# Altium schematic sheet OutputStage.SchDoc: Output stage
size A4; Revision: 1.0; SheetNumber: 4; SheetTotal: 5; Alumno: Trotta, Ignacio; Curso: R1001; Materia: Sistemas de Representación; Docentes: JM Perdomo, E Ipar
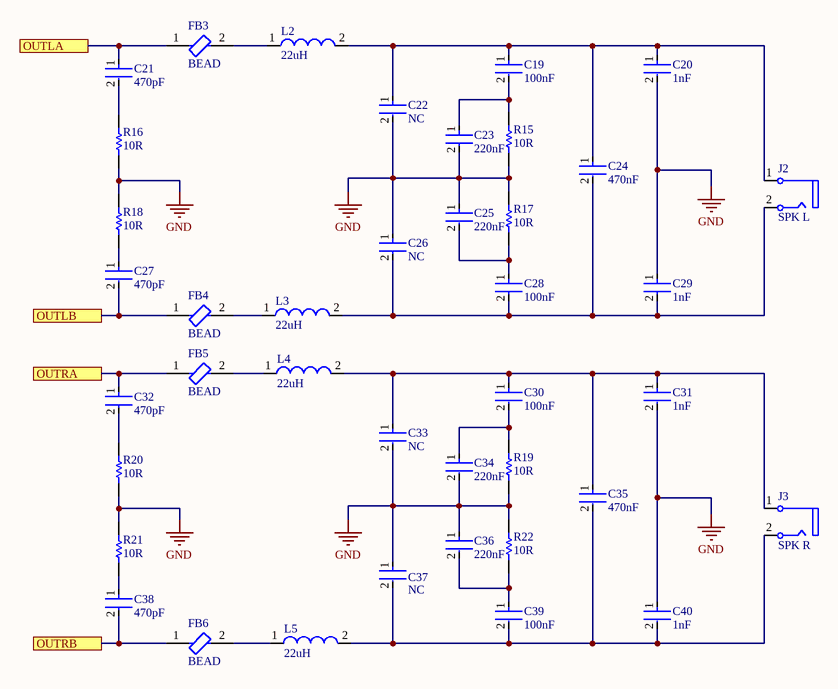
[diagram p0: OutputStage.SchDoc]

## Parts
C19  100nF  [FP-CC0805-0_85-MFG]
C20  1nF  [FP-CC0603-DA-MFG]
C21  470pF  [FP-CC0603-DA-MFG]
C22  NC  [FP-CL31-IPC_C]
C23  220nF  [FP-CC0805-0_85-MFG]
C24  470nF  [FP-CC0603-DA-MFG]
C25  220nF  [FP-CC0805-0_85-MFG]
C26  NC  [FP-CL31-IPC_C]
C27  470pF  [FP-CC0603-DA-MFG]
C28  100nF  [FP-CC0805-0_85-MFG]
C29  1nF  [FP-CC0603-DA-MFG]
C30  100nF  [FP-CC0805-0_85-MFG]
C31  1nF  [FP-CC0603-DA-MFG]
C32  470pF  [FP-CC0603-DA-MFG]
C33  NC  [FP-CL31-IPC_C]
C34  220nF  [FP-CC0805-0_85-MFG]
C35  470nF  [FP-CC0603-DA-MFG]
C36  220nF  [FP-CC0805-0_85-MFG]
C37  NC  [FP-CL31-IPC_C]
C38  470pF  [FP-CC0603-DA-MFG]
C39  100nF  [FP-CC0805-0_85-MFG]
C40  1nF  [FP-CC0603-DA-MFG]
FB3  BEAD  [FP-BLM18-0_15-t0_8-IPC_B]
FB4  BEAD  [FP-BLM18-0_15-t0_8-IPC_B]
FB5  BEAD  [FP-BLM18-0_15-t0_8-IPC_B]
FB6  BEAD  [FP-BLM18-0_15-t0_8-IPC_B]
J2  SPK L  [CUI-RCJ-041_V]
J3  SPK R  [CUI-RCJ-041_V]
L2  22uH  [WE-PD-XXL]
L3  22uH  [WE-PD-XXL]
L4  22uH  [WE-PD-XXL]
L5  22uH  [WE-PD-XXL]
R15  10R  [RESC3116X65X40NL10T20]
R16  10R  [RESC1608X55X25ML10T15]
R17  10R  [RESC3116X65X40NL10T20]
R18  10R  [RESC1608X55X25ML10T15]
R19  10R  [RESC3116X65X40NL10T20]
R20  10R  [RESC1608X55X25ML10T15]
R21  10R  [RESC1608X55X25ML10T15]
R22  10R  [RESC3116X65X40NL10T20]

## Ports
OUTLA, OUTLB, OUTRA, OUTRB

## Nets
GND: C20.2 C22.2 C23.2 C25.1 C26.1 C29.1 C31.2 C33.2 C34.2 C36.1 C37.1 C40.1 R15.1 R16.1 R17.2 R18.2 R19.1 R20.1 R21.2 R22.2
OUTLA: C21.1 FB3.1 ; port OUTLA
OUTLB: C27.2 FB4.1 ; port OUTLB
OUTRA: C32.1 FB5.1 ; port OUTRA
OUTRB: C38.2 FB6.1 ; port OUTRB
NetC19_1: C19.1 C20.1 C22.1 C24.1 J2.1 L2.2
NetC19_2: C19.2 C23.1 R15.2
NetC21_2: C21.2 R16.2
NetC24_2: C24.2 C26.2 C28.2 C29.2 J2.2 L3.2
NetC25_2: C25.2 C28.1 R17.1
NetC27_1: C27.1 R18.1
NetC30_1: C30.1 C31.1 C33.1 C35.1 J3.1 L4.2
NetC30_2: C30.2 C34.1 R19.2
NetC32_2: C32.2 R20.2
NetC35_2: C35.2 C37.2 C39.2 C40.2 J3.2 L5.2
NetC36_2: C36.2 C39.1 R22.1
NetC38_1: C38.1 R21.1
NetFB3_2: FB3.2 L2.1
NetFB4_2: FB4.2 L3.1
NetFB5_2: FB5.2 L4.1
NetFB6_2: FB6.2 L5.1

## Notes on the sheet
- Title:
- Revision:
- Alumno:
- Materia:
- Docentes:
- Curso:
- File:
- Date:
- Sheet
- of

## Library data of the parts
C19 C28 C30 C39 = CMP-03422-000996-1: CAP CER 0.22UF 50V X7R 0805; Manufacturer: Yageo; Manufacturer Part Number: CC0805KKX7R9BB224; Description: CC0805 220 nF X7R 10.00% 50 V; Tolerance: 0.1; Capacitance: 220 nF; Value: 220 nF; Material: Ceramic; ComponentLink2Description: Datasheet; Temperature Range Low: -30°C; Package: CC0805-0.85; Ipc Land Pattern Name: CAPC200125X85; Lead Free: Yes; Temperature Range High: +85°C; Category: Cap; Temperature: -30°C to +85°C; RoHS: TRUE; Device Class L3: Ceramic Capacitors; ComponentLink2URL: http://www.yageo.com/documents/recent/UPY-GPHC_Y5V_6.3V-to-50V_8.pdf; Voltage Rating: 50 V; Octopart: https://octopart.com/cc0805kkx7r9bb224-yageo-20779595; Digikey Description: CAP CER 0.22UF 50V X7R 0805; Device Class L1: Passive Components; Temperature Characteristic: X7R; Footprint Url: http://www.yageo.com/exep/pages/download/literatures/UPY-C_GEN_24.pdf; Height: 0.95mm; Device Class L2: Capacitors; Automotive: No; Mouser Description: Multilayer Ceramic Capacitors MLCC - SMD/SMT 220nF 50V X7R 10%
C20 C21 C24 C27 C29 C31 C32 C35 C38 C40 = CMP-2100-03600-2: CAP CER 10000PF 50V X7R 0603; Manufacturer Part Number: CC0603KRX7R9BB103; Manufacturer: YAGEO; Tolerance: 0.1; Material: Ceramic; Temperature Coefficient: 15%; Description: CC0603 10 nF X7R 10.00% 50 V; Value: 10 nF; Mouser Description: Multilayer Ceramic Capacitor, CC Series, 0.01 - F, - 10%, X7R, 50 V, 0603 [1608 Metric]; Digikey Description: CAP CER 10000PF 50V X7R 0603; Height: 0.9mm; Category: Cap; Temperature Characteristic: X7R; Footprint Url: http://www.yageo.com/exep/pages/download/literatures/UPY-C_GEN_24.pdf; Lead Free: Yes; Voltage Rating: 50 V; Temperature: -55°C to +125°C; Device Class L3: Ceramic Capacitors; ComponentLink2Description: Datasheet; Voltage: 50 V; Package: CC0603-DA; Octopart: https://octopart.com/cc0603krx7r9bb103-yageo-192938; Automotive: No; Temperature Range High: +125°C; Temperature Range Low: -55°C; RoHS: TRUE; Device Class L1: Passive Components; ComponentLink2URL: http://www.yageo.com/documents/recent/UPY-GPHC_X7R_6.3V-to-50V_18.pdf; Device Class L2: Capacitors; Capacitance: 10 nF
C22 C26 C33 C37 = CMP-13271-000934-1: Cap Ceramic 1nF 2kV X7R ±20% SMD 1206 +125°C Embossed T/R; Width: 0.063inch; Voltage Rating (DC): 2kV; Voltage Rating: 2kV; Package Quantity: 1; Max Operating Temperature: 125°C; Mount: Surface Mount; Packaging: Tape and Reel; Length: 0.126inch; Capacitance: 1nF; Case Code (Imperial): 1206; Min Operating Temperature: -55°C; Case/Package: 1206; Case Code (Metric): 3216; Tolerance: 20%; Thickness: 0.071inch
C23 C25 C34 C36 = CMP-03422-000996-1: CAP CER 0.22UF 50V X7R 0805; Manufacturer: Yageo; Manufacturer Part Number: CC0805KKX7R9BB224; Description: CC0805 220 nF X7R 10.00% 50 V; Tolerance: 0.1; Material: Ceramic; ComponentLink2Description: Datasheet; Temperature Range Low: -30°C; Package: CC0805-0.85; Ipc Land Pattern Name: CAPC200125X85; Lead Free: Yes; Temperature Range High: +85°C; Category: Cap; Temperature: -30°C to +85°C; RoHS: TRUE; Device Class L3: Ceramic Capacitors; ComponentLink2URL: http://www.yageo.com/documents/recent/UPY-GPHC_Y5V_6.3V-to-50V_8.pdf; Voltage Rating: 50 V; Octopart: https://octopart.com/cc0805kkx7r9bb224-yageo-20779595; Capacitance: 220 nF; Value: 220 nF; Digikey Description: CAP CER 0.22UF 50V X7R 0805; Device Class L1: Passive Components; Temperature Characteristic: X7R; Footprint Url: http://www.yageo.com/exep/pages/download/literatures/UPY-C_GEN_24.pdf; Height: 0.95mm; Device Class L2: Capacitors; Automotive: No; Mouser Description: Multilayer Ceramic Capacitors MLCC - SMD/SMT 220nF 50V X7R 10%
FB3-FB6 = CMP-0686-00503-3: Chip Ferrite Bead, 0603, 75Ω @ 100MHz, 0.3Ω, 25%, 600mA; Resistance: 350mR; Max DC Current: 500mA; Shielding: Unshielded; Number of Lines: 1; Impedance: 75R; Conductor Material: Copper; Material: Steel; DC Resistance (DCR): 300mR; Temperature Coefficient: 10ppm/°C; Max Current Rating: 500mA; Case/Package: 0603; Case Code (Imperial): 0603; DC Current: 500mA; Test Frequency: 100MHz; Military Standard: Not; Series: BLM18B; Min Operating Temperature: -55°C; Number of Pins: 2; Termination: SMD/SMT; Length: 1.6mm; Packaging: Tape and Reel; Max Operating Temperature: 125°C; Package Quantity: 1; REACH SVHC: No SVHC; Height: 0.8mm; Radiation Hardening: No; Depth: 0.8mm; Tolerance: 25%; Current Rating: 500mA; Width: 0.8mm; Core Material: Ferrite; RoHS Compliant: Yes; DC Resistance-Max: 300mR; Lead Free: Lead Free; Case Code (Metric): 1608; Number of Circuits: 1
J2 J3 = CMP-1692-00002-1: Female RCJ Jack, 2 Position, Height 11.724 mm, Tail Length 4 mm, RoHS, Bulk; Case\Package: Metal; Connector Type: HDMI; Current Rating: 500 mA; Voltage Rating: 40 V; Length: 16.2 mm; Pins: 19; ComponentLink1URL: http://www.cui.com/; ComponentLink1Description: Manufacturer URL; Packaging: Tape and Reel; Lead Pitch: 0.5 mm; PackageDescription: Female RCJ Jack, 2 Position, Height 11.724 mm, Tail Length 4 mm; RoHSCompliant: true; Min Operating Temperature: -55 degC; Height: 6.1 mm; Contact Material: Copper; REACH SVHC: No SVHC; DatasheetVersion: Rev. B, 02/2012; ComponentLink2Description: Datasheet; Contact Plating: Gold; Colour: Black; Max Operating Temperature: 85 degC; Mount: Surface Mount; Package Quantity: 400; Gender: Female; ComponentLink2URL: http://www.cui.com/product/resource/rcj-04x.pdf; PackageReference: RCJ-041
L2-L5 = CMP-0227-00178-1: SMD-Shielded Power Inductor WE-PD, L = 22.0 µH; Inductance: 22.0 ÂµH; DatasheetVersion: ver 1, Oct-2004; ComponentLink2URL: http://www.we-online.de/katalog/media/pdf/7447709220.pdf; PackageDescription: SMD Inductor, 2-Leads, Body 12.0 x 12.0 mm; PackageVersion: 2004; ComponentLink2Description: Datasheet; PackageReference: WE-PD-XXL; ComponentLink1URL: http://www.we-online.com; ComponentLink1Description: Manufacturer Link
R15 R17 R19 R22 = CMP-2003-03943-1: Part Number: RC1206JR-07100ML; Manufacturer: Yageo
R16 R18 R20 R21 = CMP-2000-05021-1: Chip Resistor, 100 Ohm, +/- 5%, 50 V, 0603 (1608 Metric), RoHS, Tape and Reel; Manufacturer: Yageo; Temperature Coefficient: 100PPM/C; Resistance: 100Ohms; Power Rating: 100mW; Voltage Rating: 50V; Manufacturer URL: http://www.yageo.com/; Product: ThickFilmResistorsGeneralPurpose; Package Description: 2-Pin Surface Mount Device, Body 1.6 x 0.8 mm; Tolerance: 5%; Termination Style: SMD/SMT; Datasheet URL: http://www.farnell.com/datasheets/443971.pdf; Operating Temperature Range: -55Cto+155C; Packaging: Reel; Case Code - in: 0603; Package Reference: 603; Series: RC; Case Code - mm: 1608; Datasheet Version: Rev. 4, 04/2009